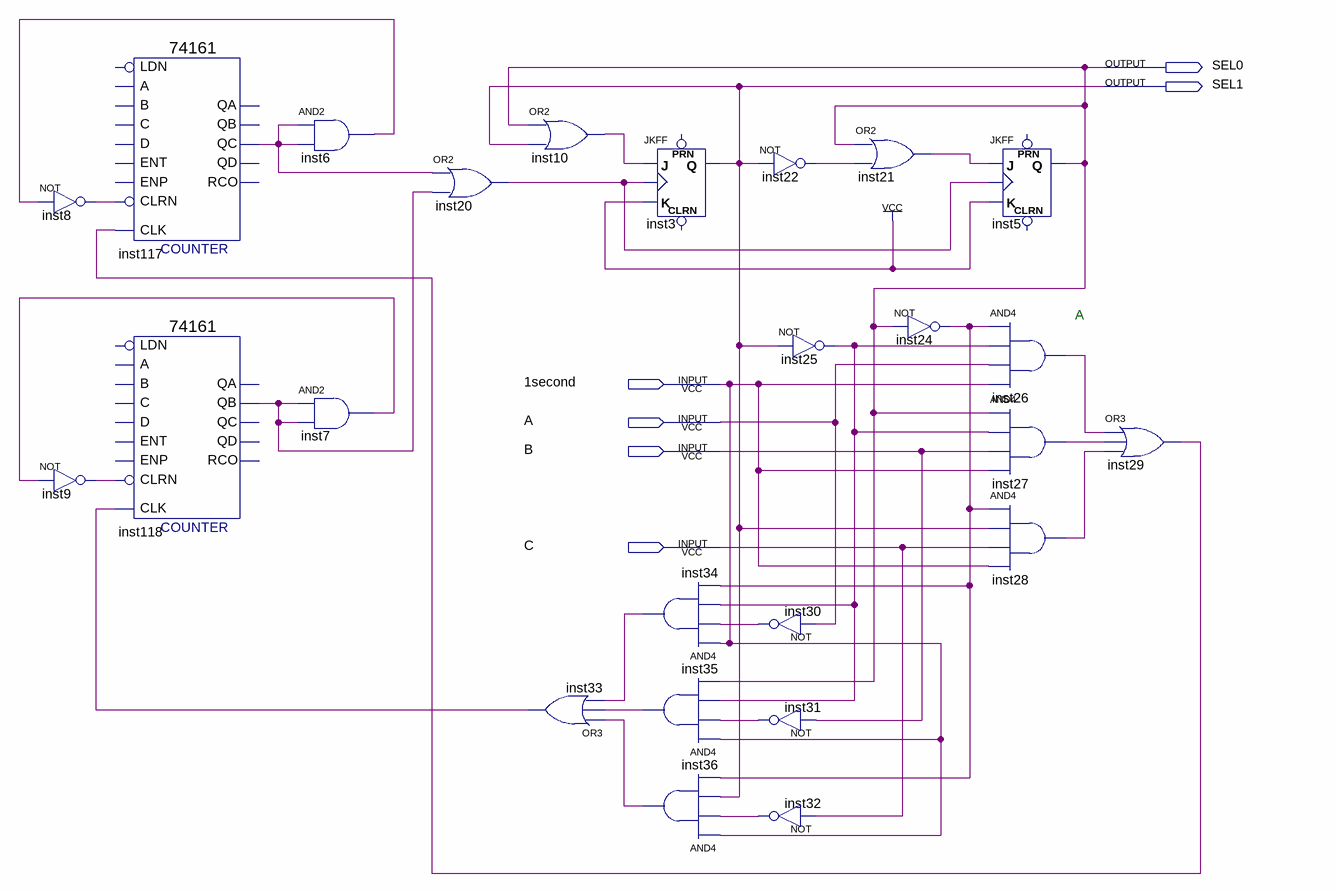
[diagram p0: schematic sheet]
// Quartus schematic seletor.bdf as structural Verilog: 25 symbols, 6 pins
module seletor (
  input  \1second ,
  input  A,
  input  B,
  input  C,
  output SEL0,
  output SEL1
);

  wire inst6_out, inst7_out, inst8_out, inst9_out, inst10_out, inst20_out, inst21_out, inst22_out,
       inst24_out, inst25_out, inst26_out, inst27_out, inst28_out, inst29_out, inst30_out, inst31_out,
       inst32_out, inst33_out, inst34_out, inst35_out, inst36_out, inst117_qc, inst118_qb;

  not inst8 (inst8_out, inst6_out);
  not inst9 (inst9_out, inst7_out);
  \74161  inst117 (
    .CLRN(inst8_out), .CLK(inst29_out), .QC(inst117_qc));  // open: ENP, LDN, A, D, ENT, B, C, QD, QB, QA, RCO
  \74161  inst118 (
    .CLRN(inst9_out), .CLK(inst33_out), .QB(inst118_qb));  // open: ENP, LDN, A, D, ENT, B, C, QD, QC, QA, RCO
  and inst6 (inst6_out, inst117_qc, inst117_qc);
  and inst7 (inst7_out, inst118_qb, inst118_qb);
  or inst20 (inst20_out, inst117_qc, inst118_qb);
  or inst10 (inst10_out, SEL0, SEL1);
  or inst33 (inst33_out, inst36_out, inst35_out, inst34_out);
  JKFF inst3 (.K(1'b1), .J(inst10_out), .CLK(inst20_out), .Q(SEL1));  // open: PRN, CLRN
  and inst34 (inst34_out, \1second , inst30_out, inst25_out, inst24_out);
  and inst35 (inst35_out, \1second , inst31_out, inst25_out, SEL0);
  and inst36 (inst36_out, \1second , inst32_out, SEL1, inst24_out);
  not inst22 (inst22_out, SEL1);
  not inst25 (inst25_out, SEL1);
  not inst30 (inst30_out, A);
  not inst31 (inst31_out, B);
  not inst32 (inst32_out, C);
  or inst21 (inst21_out, SEL0, inst22_out);
  not inst24 (inst24_out, SEL0);
  JKFF inst5 (.K(1'b1), .J(inst21_out), .CLK(inst20_out), .Q(SEL0));  // open: PRN, CLRN
  and inst26 (inst26_out, inst24_out, inst25_out, A, \1second );
  and inst27 (inst27_out, SEL0, inst25_out, B, \1second );
  and inst28 (inst28_out, inst24_out, SEL1, C, \1second );
  or inst29 (inst29_out, inst26_out, inst27_out, inst28_out);

  // Notes on the sheet:
  //   A
endmodule
